# Altium schematic sheet PCB_tesis_p2.SchDoc
size A4
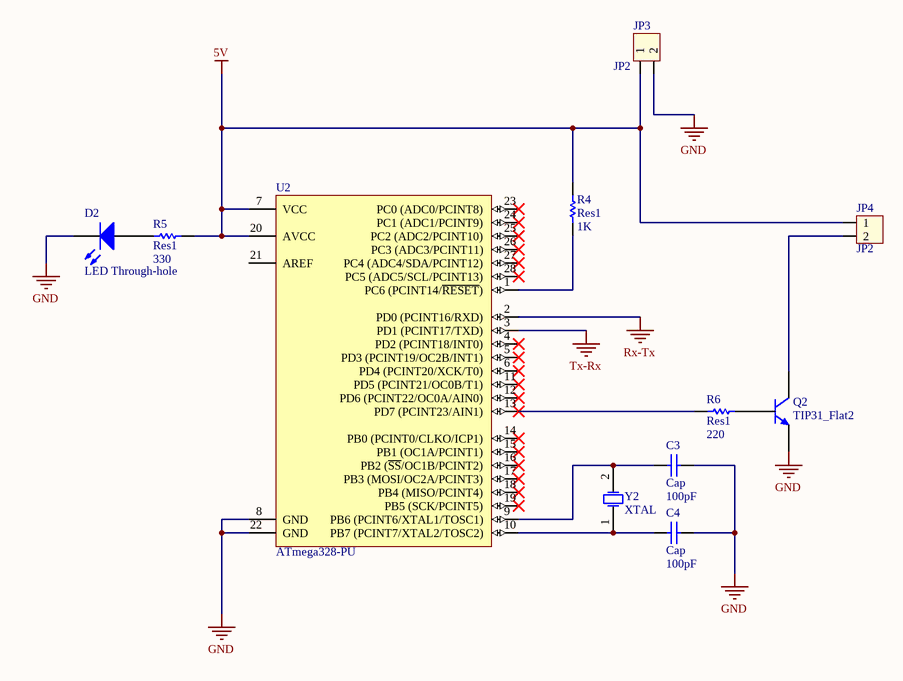
[diagram p0: PCB_tesis_p2.SchDoc]

## Parts
C3  Cap  value 100pF  [Ceramic Capacitor]
C4  Cap  value 100pF  [Ceramic Capacitor]
D2  LED Through-hole  [LED 3MM Red]
JP3  JP2  [CON2]
JP4  JP2  [CON2]
Q2  TIP31_Flat2  [TO-220HS - 2]
R4  Res1  value 1K  [AXIAL-0.3]
R5  Res1  value 330  [AXIAL-0.3]
R6  Res1  value 220  [AXIAL-0.3]
U2  ATmega328-PU  [28P3]
Y2  XTAL  [HC-49U]

## Nets
5V: JP3.1 JP4.1 R4.2 R5.1 U2.7(VCC) U2.20(AVCC)
GND: C3.2 C4.2 D2.2(K) JP3.2 Q2.3(Emisor) U2.8(GND) U2.22(GND)
Rx-Tx: U2.2(PD0_(PCINT16/RXD))
Tx-Rx: U2.3(PD1_(PCINT17/TXD))
NetC3_1: C3.1 U2.9(PB6_(PCINT6/XTAL1/TOSC1)) Y2.2(OSC2)
NetC4_1: C4.1 U2.10(PB7_(PCINT7/XTAL2/TOSC2)) Y2.1(OSC1)
NetD2_1: D2.1(A) R5.2
NetJP4_2: JP4.2 Q2.2(Colector)
NetQ2_1: Q2.1(Base) R6.1
NetR4_1: R4.1 U2.1(PC6_(PCINT14/~{RESET}))
NetR6_2: R6.2 U2.13(PD7_(PCINT23/AIN1))

Not connected (* = marked no-connect by the designer): U2 4(PD2_(PCINT18/INT0))* 5(PD3_(PCINT19/OC2B/INT1))* 6(PD4_(PCINT20/XCK/T0))* 11(PD5_(PCINT21/OC0B/T1))* 12(PD6_(PCINT22/OC0A/AIN0))* 14(PB0_(PCINT0/CLKO/ICP1))* 15(PB1_(OC1A/PCINT1))* 16(PB2_(~{SS}/OC1B/PCINT2))* 17(PB3_(MOSI/OC2A/PCINT3))* 18(PB4_(MISO/PCINT4))* 19(PB5_(SCK/PCINT5))* 21(AREF) 23(PC0_(ADC0/PCINT8))* 24(PC1_(ADC1/PCINT9))* 25(PC2_(ADC2/PCINT10))* 26(PC3_(ADC3/PCINT11))* 27(PC4_(ADC4/SDA/PCINT12))* 28(PC5_(ADC5/SCL/PCINT13))*

## Library data of the parts
C3 C4 = Cap: Capacitor; Published: 8-Jun-2000; LatestRevisionDate: 17-Jul-2002; LatestRevisionNote: Re-released for DXP Platform.; PackageReference: RAD-0.3; Publisher: Altium Limited; PackageDescription: Radial Cap, Thru-Hole; 2 Leads; 0.3 in Pin Spacing
D2 = LED Through-hole: Typical INFRARED GaAs LED; Latest Reviewer: Zion Blue; Published: 8-Feb-2014; LatestRevisionDate: 21-Jun-2014; LatestRevisionNote: Included Footprint; Publisher: Cynetik Group; Mounting Type: Through-Hole
JP3 JP4 = Con2: Connector 2; Value: Connector 2
Q2 = TIP31_Flat2: NPN Epitaxial Silicon Transistor; Latest Reviewer: Fenrrich; Latest Revision Note: URL replaced; Publisher: Cynetik Group; Published: 6-Jun-2014; ComponentLinkURL: https://www.fairchildsemi.com/datasheets/TI/TIP31C.pdf; Latest Revision Date: 21-Jan-2015
R4-R6 = Res1: Resistor; Published: 8-Jun-2000; LatestRevisionDate: 17-Jul-2002; LatestRevisionNote: Re-released for DXP Platform.; PackageReference: AXIAL-0.3; Publisher: Altium Limited; PackageDescription: Axial Device, Thru-Hole; 2 Leads; 0.3 in Pin Spacing
U2 = ATmega328-PU: 8-bit AVR Microcontroller, 32KB Flash, 1KB EEPROM, 2KB SRAM, 28-pin PDIP, Industrial Grade (-40°C to 85°C); Published: 1-Apr-2010; DatasheetVersion: revA, Jan-2010; PackageVersion: revB, Sep-2001; PackageReference: 28P3; Publisher: Altium Limited; PackageDescription: 28-lead (0.300"/7.62mm Wide) Plastic Dual Inline Package (PDIP); Supplier 1: Digi-Key; Supplier Part Number 1: ATMEGA328-PU-ND; Supplier 2: Mouser; Supplier Part Number 2: 556-ATMEGA328-PU; ComponentLink1Description: Manufacturer Link; ComponentLink1URL: http://www.atmel.com/products/avr/default.asp?; ComponentLink2Description: ATmega48A/48PA/88A/88PA/168A/168PA/328/328P Datasheet; ComponentLink2URL: http://www.atmel.com/dyn/resources/prod_documents/8271.pdf; ComponentLink3Description: ATmega48A/48PA/88A/88PA/168A/168PA/328/328P Summary; ComponentLink3URL: http://www.atmel.com/dyn/resources/prod_documents/8271S.pdf; ComponentLink4Description: Atmel.com Home; ComponentLink4URL: http://www.atmel.com
Y2 = XTAL: Crystal Oscillator; Published: 8-Jun-2000; LatestRevisionDate: 17-Jul-2002; LatestRevisionNote: Re-released for DXP Platform.; PackageReference: R38; Publisher: Altium Limited; PackageDescription: Crystal, Thru-Hole; 2 Leads; Body 3.1 x 8.2 mm (Dia.xH)